# EAGLE schematic Symulator (EAGLE 9.6.2)
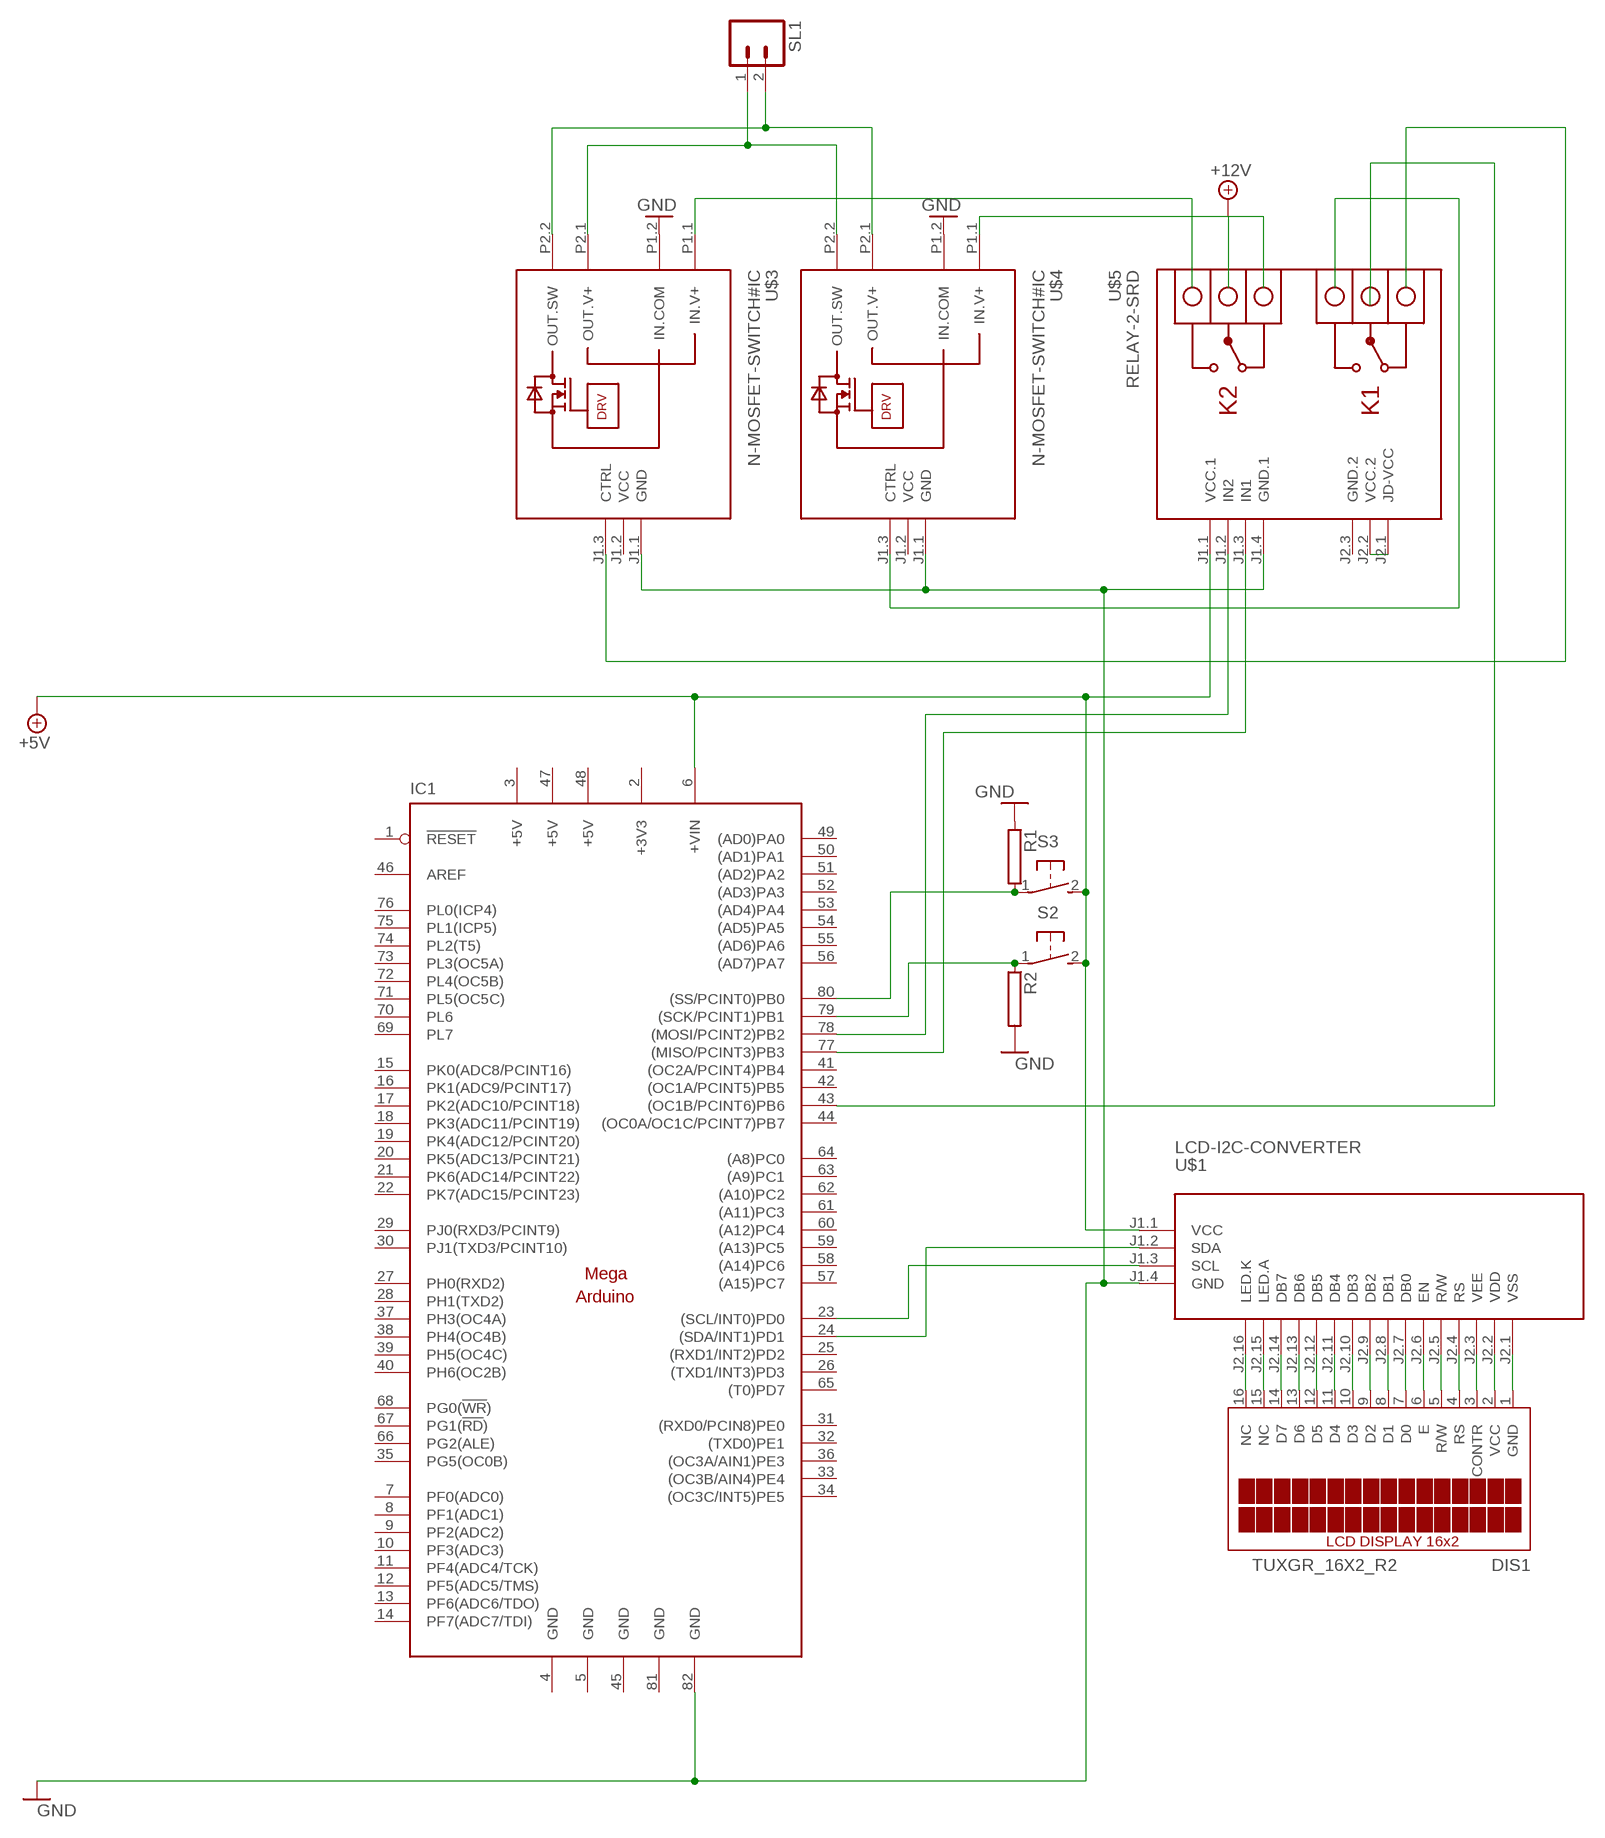
[diagram p0: schematic, sheet 1]

## Parts
DIS1  TUXGR_16X2_R2  [TUXGR_16X2_R2]
IC1  MEGAARDUINO_11  [MEGA_ARDUINO_1]
R1  RMG100-V  [TO-247-2V]
R2  RMG100-V  [TO-247-2V]
S2  31-XX  [B3F-31XX]
S3  31-XX  [B3F-31XX]
SL1  M02  [02P]
U$1  LCD-I2C-CONVERTER  [LCD-I2C-CONVERTER]
U$3  N-MOSFET-SWITCH#IC  [N-MOSFET-SWITCH#IC]
U$4  N-MOSFET-SWITCH#IC  [N-MOSFET-SWITCH#IC]
U$5  RELAY-2-SRD  [RELAY-2-SRD]

## Nets
+5V: IC1.6(+VIN) S2.2(S) S3.2(S) U$1.J1.1(VCC) U$5.J1.1(VCC.1)
GND: IC1.82(GND) R1.1 R2.2 U$1.J1.4(GND) U$3.J1.1(GND) U$3.P1.2(IN.COM) U$4.J1.1(GND) U$4.P1.2(IN.COM) U$5.J1.4(GND.1)
N$1: DIS1.1(GND) U$1.J2.1(VSS)
N$2: DIS1.2(VCC) U$1.J2.2(VDD)
N$3: DIS1.3(CONTR) U$1.J2.3(VEE)
N$4: DIS1.4(RS) U$1.J2.4(RS)
N$5: DIS1.5(R/W) U$1.J2.5(R/W)
N$6: DIS1.6(E) U$1.J2.6(EN)
N$7: DIS1.7(D0) U$1.J2.7(DB0)
N$8: DIS1.8(D1) U$1.J2.8(DB1)
N$9: DIS1.9(D2) U$1.J2.9(DB2)
N$10: DIS1.10(D3) U$1.J2.10(DB3)
N$11: DIS1.11(D4) U$1.J2.11(DB4)
N$12: DIS1.12(D5) U$1.J2.12(DB5)
N$13: DIS1.13(D6) U$1.J2.13(DB6)
N$14: DIS1.14(D7) U$1.J2.14(DB7)
N$15: DIS1.15(NC) U$1.J2.15(LED.A)
N$16: DIS1.16(NC) U$1.J2.16(LED.K)
N$17: IC1.79((SCK/PCINT1)PB1) R2.1 S2.1(P)
N$18: SL1.1 U$3.P2.1(OUT.V+) U$4.P2.2(OUT.SW)
N$19: IC1.80((SS/PCINT0)PB0) R1.2 S3.1(P)
N$20: IC1.23((SCL/INT0)PD0) U$1.J1.3(SCL)
N$21: IC1.24((SDA/INT1)PD1) U$1.J1.2(SDA)
N$22: IC1.77((MISO/PCINT3)PB3) U$5.J1.3(IN1)
N$24: U$5.J2.1(JD-VCC) U$5.J2.2(VCC.2)
N$25: IC1.43((OC1B/PCINT6)PB6)
N$26: SL1.2 U$3.P2.2(OUT.SW) U$4.P2.1(OUT.V+)
N$27: U$3.J1.3(CTRL)
N$28: U$4.P1.1(IN.V+)
N$29: U$3.P1.1(IN.V+)
N$30: U$4.J1.3(CTRL)
N$31: IC1.78((MOSI/PCINT2)PB2) U$5.J1.2(IN2)
Unconnected: IC1.1(!RESET) IC1.7(PF0(ADC0)) IC1.8(PF1(ADC1)) IC1.9(PF2(ADC2)) IC1.10(PF3(ADC3)) IC1.11(PF4(ADC4/TCK)) IC1.12(PF5(ADC5/TMS)) IC1.13(PF6(ADC6/TDO)) IC1.14(PF7(ADC7/TDI)) IC1.15(PK0(ADC8/PCINT16)) IC1.16(PK1(ADC9/PCINT17)) IC1.17(PK2(ADC10/PCINT18)) IC1.18(PK3(ADC11/PCINT19)) IC1.19(PK4(ADC12/PCINT20)) IC1.20(PK5(ADC13/PCINT21)) IC1.21(PK6(ADC14/PCINT22)) IC1.22(PK7(ADC15/PCINT23)) IC1.25((RXD1/INT2)PD2) IC1.26((TXD1/INT3)PD3) IC1.27(PH0(RXD2)) IC1.28(PH1(TXD2)) IC1.29(PJ0(RXD3/PCINT9)) IC1.30(PJ1(TXD3/PCINT10)) IC1.31((RXD0/PCIN8)PE0) IC1.32((TXD0)PE1) IC1.33((OC3B/AIN4)PE4) IC1.34((OC3C/INT5)PE5) IC1.35(PG5(OC0B)) IC1.36((OC3A/AIN1)PE3) IC1.37(PH3(OC4A)) IC1.38(PH4(OC4B)) IC1.39(PH5(OC4C)) IC1.40(PH6(OC2B)) IC1.41((OC2A/PCINT4)PB4) IC1.42((OC1A/PCINT5)PB5) IC1.44((OC0A/OC1C/PCINT7)PB7) IC1.46(AREF) IC1.49((AD0)PA0) IC1.50((AD1)PA1) IC1.51((AD2)PA2) IC1.52((AD3)PA3) IC1.53((AD4)PA4) IC1.54((AD5)PA5) IC1.55((AD6)PA6) IC1.56((AD7)PA7) IC1.57((A15)PC7) IC1.58((A14)PC6) IC1.59((A13)PC5) IC1.60((A12)PC4) IC1.61((A11)PC3) IC1.62((A10)PC2) IC1.63((A9)PC1) IC1.64((A8)PC0) IC1.65((T0)PD7) IC1.66(PG2(ALE)) IC1.67(PG1(!RD!)) IC1.68(PG0(!WR!)) IC1.69(PL7) IC1.70(PL6) IC1.71(PL5(OC5C)) IC1.72(PL4(OC5B)) IC1.73(PL3(OC5A)) IC1.74(PL2(T5)) IC1.75(PL1(ICP5)) IC1.76(PL0(ICP4))

## Power pins joined to a net without a drawn wire
+3V3: IC1.2(+3V3)
+5V: IC1.3(+5V) IC1.47(+5V) IC1.48(+5V)
GND: IC1.4(GND) IC1.5(GND) IC1.45(GND) IC1.81(GND)
GND.2: U$5.J2.3(GND.2)
VCC: U$3.J1.2(VCC) U$4.J1.2(VCC)

## Library data of the parts
DIS1 = display-lcd:TUXGR_16X2_R2: Tuxgraphics LCD display 16x2 characters reflective, without background light Source: tuxgr_12x2_r2.pdf; OC_FARNELL: unknown; OC_NEWARK: unknown
IC1 = arduino:MEGAARDUINO_1: The Arduino Mega is a microcontroller board based on the ATmega1280. - 54 digital input/output pins (of which 14 can be used as PWM outputs) - 16 analog inputs - 4 UARTs (hardware serial ports) - 16 MHz crystal oscillator - USB connection - power jack - ICSP header - reset button It contains everything needed to support the microcontroller; simply connect it to a computer with a USB cable or power it with a AC-to-DC adapter or battery to get started. The Mega is compatible with most shields designed for the Arduino Duemilanove or Diecimila. http://arduino.cc/en/Main/ArduinoBoardMega
R1 R2 = resistor-power:RMG100: TO-247 Power Resistor - RMG 100 Series Source: www.token.com.tw .. power-resistor-rmg100pdf; OC_FARNELL: unknown; OC_NEWARK: unknown
S2 S3 = switch-omron:31-XX: OMRON SWITCH; MPN: B3F-3100; OC_FARNELL: 959704; OC_NEWARK: 36M3582
SL1 = con-amp-quick:M02: AMP QUICK CONNECTOR; OC_FARNELL: unknown; OC_NEWARK: unknown
U$1 = diy-modules:LCD-I2C-CONVERTER: I2C Bus to 4-Bit Parallel LCD Interface with LED backlight driver
U$3 U$4 = diy-modules:N-MOSFET-SWITCH#IC: Low Side N-MOSFET Switch with Optocoupler Device with connector pins Click here to find device on ebay.com <http://www.ebay.com/sch/1+route+mosfet+button+irf540>
U$5 = diy-modules:RELAY-2-SRD: 2-Channel Relay Module based on SRD-05VDC-SL-C relays Click here to find device on ebay.com <http://www.ebay.com/sch/two+channel+relay+module+optocoupler+5v>